# EAGLE design dbLcdRtcUno (EAGLE 8.4.3)
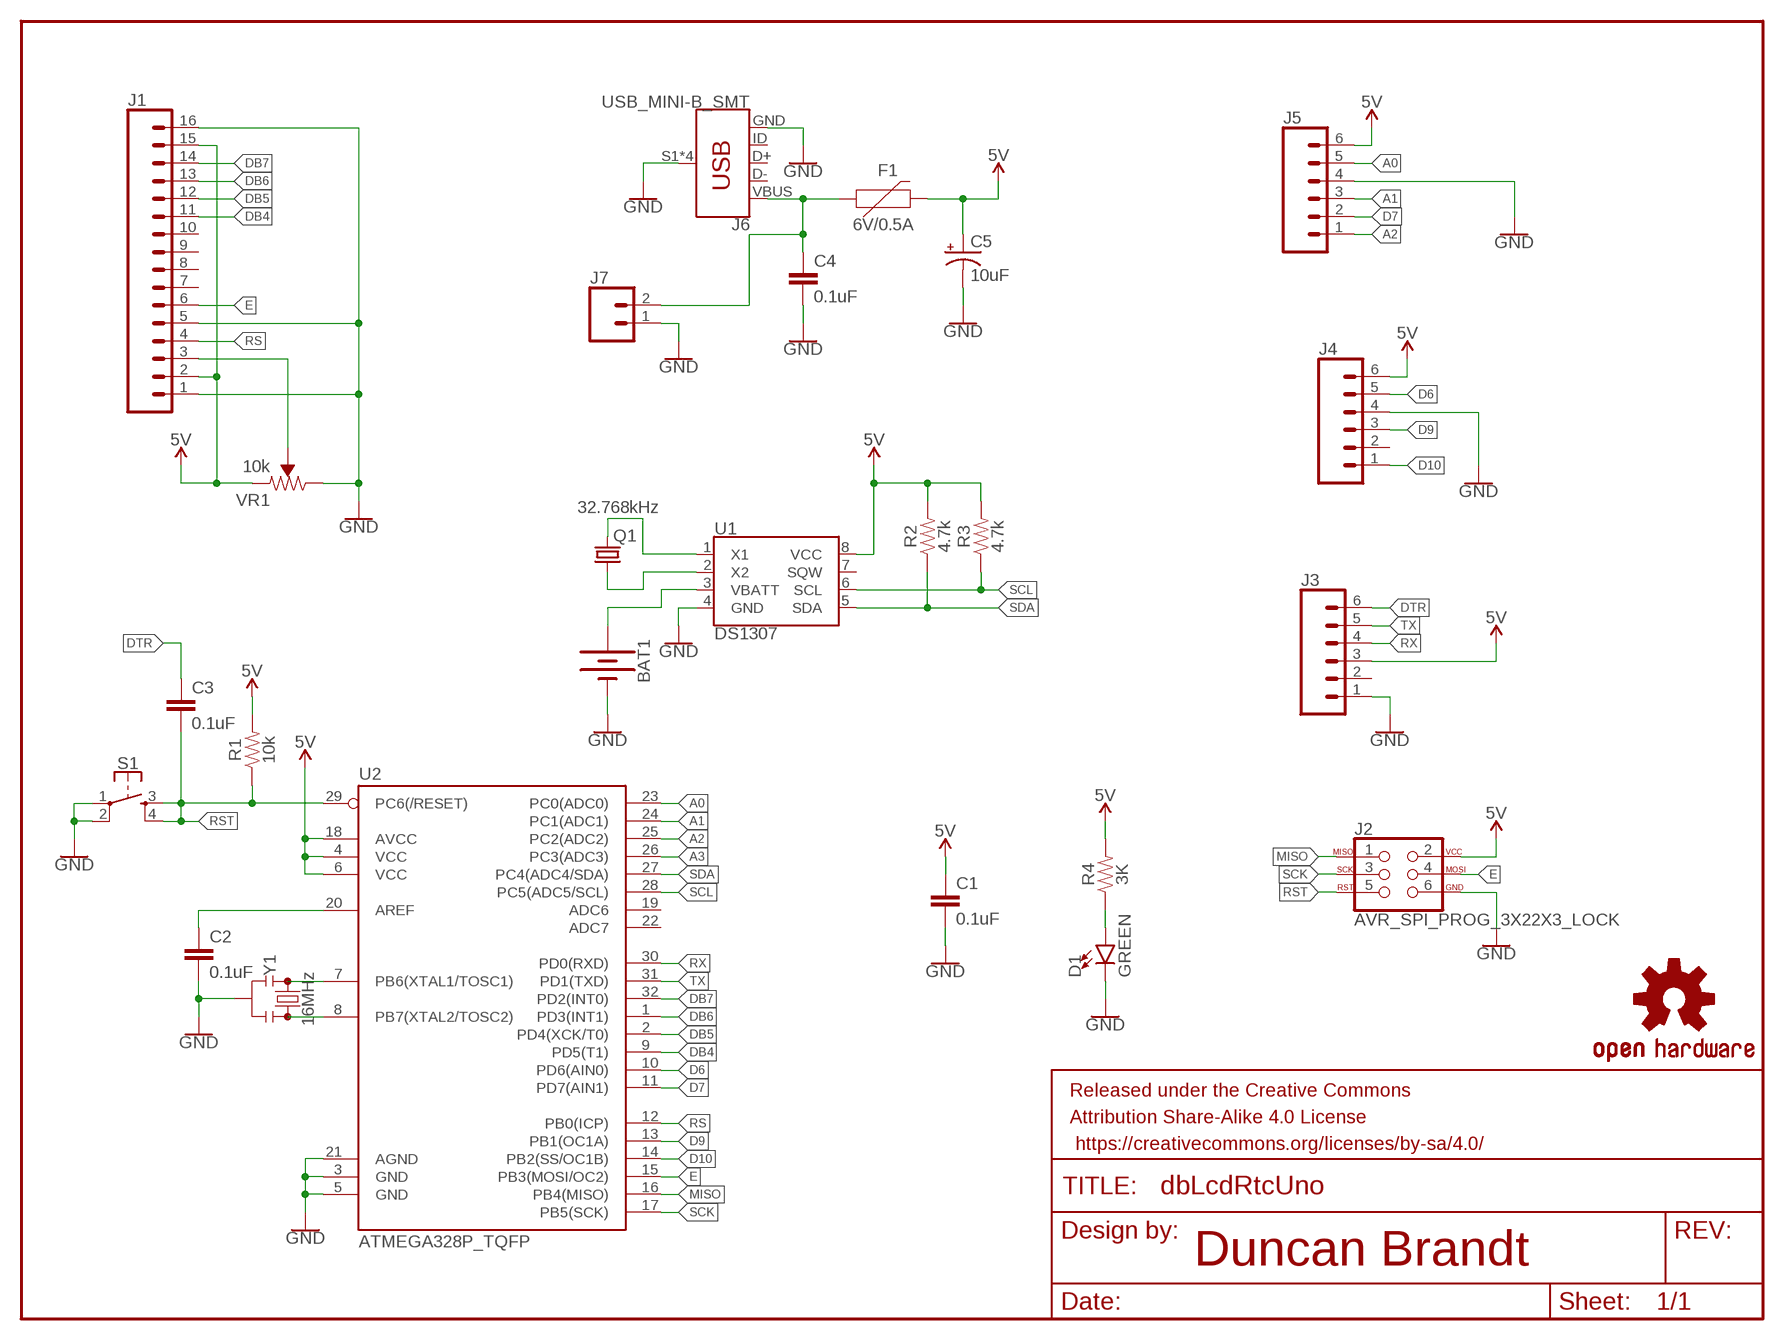
[diagram p0: schematic, sheet 1]

## Parts
BAT1  BATTERY-12MM_PTH  [BATTCON_12MM_PTH]
C1  0.1uF  0.1UF-0603-25V-5%  [0603]
C2  0.1uF  0.1UF-0603-25V-5%  [0603]
C3  0.1uF  0.1UF-0603-25V-5%  [0603]
C4  0.1uF  0.1UF-0603-25V-5%  [0603]
C5  10uF  10UF-POLAR-EIA3216-16V-10%(TANT)  [EIA3216]
D1  GREEN  LED-GREEN1206  [LED-1206]
F1  6V/0.5A  PPTC_HALF-AMP  [1206]
FRAME1  FRAME-LETTER  [CREATIVE_COMMONS]
J1  CONN_16  [1X16]
J2  AVR_SPI_PROG_3X22X3_LOCK  [2X3_LOCK]
J3  CONN_06SILK_FEMALE_PTH  [1X06]
J4  CONN_06SILK_FEMALE_PTH  [1X06]
J5  CONN_06SILK_FEMALE_PTH  [1X06]
J6  USB_MINI-B_SMT  [USB-MINIB]
J7  CONN_02  [1X02]
LOGO1  OSHW-LOGOL  [OSHW-LOGO-L]
Q1  32.768kHz  CRYSTAL-32.768KHZSMD-2X6  [CRYSTAL-SMD-2X6-CYL]
R1  10k  10KOHM-0603-1/10W-1%  [0603]
R2  4.7k  4.7KOHM-0603-1/10W-1%  [0603]
R3  4.7k  4.7KOHM-0603-1/10W-1%  [0603]
R4  3K  3KOHM-0603-1/10W-1%  [0603]
S1  MOMENTARY-SWITCH-SPST-2-SMD-5.2MM  [TACTILE_SWITCH_SMD_5.2MM]
U1  DS1307  DS1307Z  [SO08-0.15]
U2  ATMEGA328P_TQFP  [TQFP32-08]
VR1  10k  TRIMPOT-SMD-3MM-CLOSED-1/8W-20%  [TRIMPOT-SMD-3MM-CLOSED]
Y1  16MHz  RESONATOR-16MHZSMD_3.2X1.3  [RESONATOR-SMD-3.2X1.3]

## Nets
5V: C1.1 C5.+ F1.2 J1.2 J1.15 J2.2 J3.3 J4.6 J5.6 R1.2 R2.2 R3.2 R4.2 U1.8(VCC) U2.4(VCC) U2.6(VCC) U2.18(AVCC) VR1.1(CCW)
A0: J5.5 U2.23(PC0(ADC0))
A1: J5.3 U2.24(PC1(ADC1))
A2: J5.1 U2.25(PC2(ADC2))
A3: U2.26(PC3(ADC3))
D6: J4.5 U2.10(PD6(AIN0))
D7: J5.2 U2.11(PD7(AIN1))
D9: J4.3 U2.13(PB1(OC1A))
D10: J4.1 U2.14(PB2(SS/OC1B))
DB4: J1.11 U2.9(PD5(T1))
DB5: J1.12 U2.2(PD4(XCK/T0))
DB6: J1.13 U2.1(PD3(INT1))
DB7: J1.14 U2.32(PD2(INT0))
DTR: C3.1 J3.6
E: J1.6 J2.4 U2.15(PB3(MOSI/OC2))
GND: BAT1.GND(-) C1.2 C2.2 C4.2 C5.- D1.C J1.1 J1.5 J1.16 J2.6 J3.1 J4.4 J5.4 J6.GND J6.S1(SHIELD) J6.S2(SHIELD) J6.S3(SHIELD) J6.S4(SHIELD) J7.1 S1.1 S1.2 U1.4(GND) U2.3(GND) U2.5(GND) U2.21(AGND) VR1.3(CW) Y1.2
MISO: J2.1 U2.16(PB4(MISO))
N$1: Q1.X2 U1.1(X1)
N$2: Q1.X1 U1.2(X2)
N$3: U2.7(PB6(XTAL1/TOSC1)) Y1.1
N$4: BAT1.VCC@1(+) U1.3(VBATT)
N$5: U2.8(PB7(XTAL2/TOSC2)) Y1.3
N$6: J1.3 VR1.2(WIPER)
N$7: D1.A R4.1
N$8: C2.1 U2.20(AREF)
RS: J1.4 U2.12(PB0(ICP))
RST: C3.2 J2.5 R1.1 S1.3 S1.4 U2.29(PC6(/RESET))
RX: J3.4 U2.30(PD0(RXD))
SCK: J2.3 U2.17(PB5(SCK))
SCL: R3.1 U1.6(SCL) U2.28(PC5(ADC5/SCL))
SDA: R2.1 U1.5(SDA) U2.27(PC4(ADC4/SDA))
TX: J3.5 U2.31(PD1(TXD))
VBUS: C4.1 F1.1 J6.VBUS J7.2
Unconnected: J1.7 J1.8 J1.9 J1.10 J3.2 J4.2 J6.D+ J6.D- J6.ID U1.7(SQW) U2.19(ADC6) U2.22(ADC7)

## Notes on the sheet
- Duncan Brandt

## Library data of the parts
BAT1 = DB-POWER:BATTERY: Battery - Single Cell A variety of battery chemistries, sizes, and footprints.
C1-C4 = DB-CAP:0.1UF: 0.1µF ceramic capacitors Package: 0603 A capacitor is a passive two-terminal electrical component used to store electrical energy temporarily in an electric field. DB BOARDS: DB Drawing Board <www.dbboards.com>; PROD_ID: CAP-08604
C5 = DB-CAP:10UF-POLAR: 10.0µF polarized capacitors Package: EIA3216 A capacitor is a passive two-terminal electrical component used to store electrical energy temporarily in an electric field. DB BOARDS: DB Drawing Board <www.dbboards.com>; PROD_ID: CAP-00811
D1 = DB-LED:LED-GREEN: Green SMD LED Package: 1206 DB BOARDS: DB Drawing Board <www.dbboards.com>
F1 = DB-FUSE:PPTC: Resettable Fuse PPTC Package: 1206 DB BOARDS: DB Drawing Board <www.dbboards.com>; PROD_ID: RES-08585
FRAME1 = DB-SYMBOLS:FRAME-LETTER: Schematic Frame - Letter Standard 8.5x11 US Letter frame
J1 = DB-CONN:CONN_16: Multi connection point. Often used as Generic Header-pin footprint for 0.1 inch spaced/style header connections
J2 = DB-CONN:AVR_SPI_PROG_3X2: AVR ISP 6 Pin This is the reduced ISP connector for AVR programming. Common on Arduino. This footprint will take up less PCB space and can be used with a 10-pin to 6-pin adapter
J3-J5 = DB-CONN:CONN_06: 6 Pin Header Multi connection point. Often used as Generic Header-pin footprint for 0.1 inch spaced/style header connections DB BOARDS: DB Drawing Board <www.dbboards.com>; PROD_ID: CONN-08437
J6 = DB-CONN:USB_MINI-B: USB type Mini-B Connector Package: USB-MINIB DB BOARDS: DB Drawing Board <www.dbboards.com>; PROD_ID: CONN-08193; SF_ID: PRT-00587
J7 = DB-CONN:CONN_02: 2 Pin Header Single connection point. Often used as Generic Header-pin footprint for 0.1 inch spaced/style header connections DB BOARDS: DB Drawing Board <www.dbboards.com>
LOGO1 = DB-SYMBOLS:OSHW-LOGO: Open-Source Hardware (OSHW) Logo This logo indicates the piece of hardware it is found on incorporates a OSHW license and/or adheres to the definition of open source hardware found here: http://freedomdefined.org/OSHW
Q1 = DB-CLOCK:CRYSTAL-32.768KHZ: 32.768kHz Crystal Frequency: 32.768kHz Frequency Stability: ±20ppm Load Capacitance: 12.5pF (PTH-2X6 & SMD-3.2X1.5), 6pF (SMD-2X6)
R1 = DB-RES:10KOHM: 10kΩ Resistor Package: 0603 A resistor is a passive two-terminal electrical component that implements electrical resistance as a circuit element. Resistors act to reduce current flow, and, at the same time, act to lower voltage levels within circuits. - Wikipedia DB BOARDS: DB Drawing Board <www.dbboards.com>; PROD_ID: RES-00824
R2 R3 = DB-RES:4.7KOHM: 4.7kΩ Resistor Package: 0603 A resistor is a passive two-terminal electrical component that implements electrical resistance as a circuit element. Resistors act to reduce current flow, and, at the same time, act to lower voltage levels within circuits. - Wikipedia DB BOARDS: DB Drawing Board <www.dbboards.com>; PROD_ID: RES-07857
R4 = DB-RES:3KOHM: 3kΩ Resistor Package: 0603 A resistor is a passive two-terminal electrical component that implements electrical resistance as a circuit element. Resistors act to reduce current flow, and, at the same time, act to lower voltage levels within circuits. - Wikipedia DB BOARDS: DB Drawing Board <www.dbboards.com>; PROD_ID: RES-09334
S1 = DB-BTNSWTCH:MOMENTARY-SWITCH-SPST-2: SMD Momentary Push Button Package: SPST 4PIN DB BOARDS: DB Drawing Board <www.dbboards.com>; PROD_ID: SWCH-08247; SF_SKU: COM-08720
U1 = DB-IC:DS1307: Maxim DS1307 - I2C Real-time clock (RTC) The DS1307 serial real-time clock (RTC) is a low-power, full binary-coded decimal (BCD) clock/calendar plus 56 bytes of NV SRAM. Address and data are transferred serially through an I2C, bidirectional bus. The clock/calendar provides seconds, minutes, hours, day, date, month, and year information.
U2 = DB-IC-Microcontroller:ATMEGA328P_TQFP: ATMEGA 328P Package: TQFP32 Arduino Programmable IC DB BOARDS: DB Drawing Board <www.dbboards.com>; PROD_ID: IC-09069
VR1 = DB-RES:TRIMPOT: Trimming Potentiometer (Trimpot) Three-terminal potentiometers, variable resistor.; PROD_ID: RES-09285
Y1 = DB-CLOCK:RESONATOR-16MHZ: 16MHz Resonator Package: 3.2x1.3 DB BOARDS: DB Drawing Board <www.dbboards.com>; PROD_ID: XTAL-08900

## Board
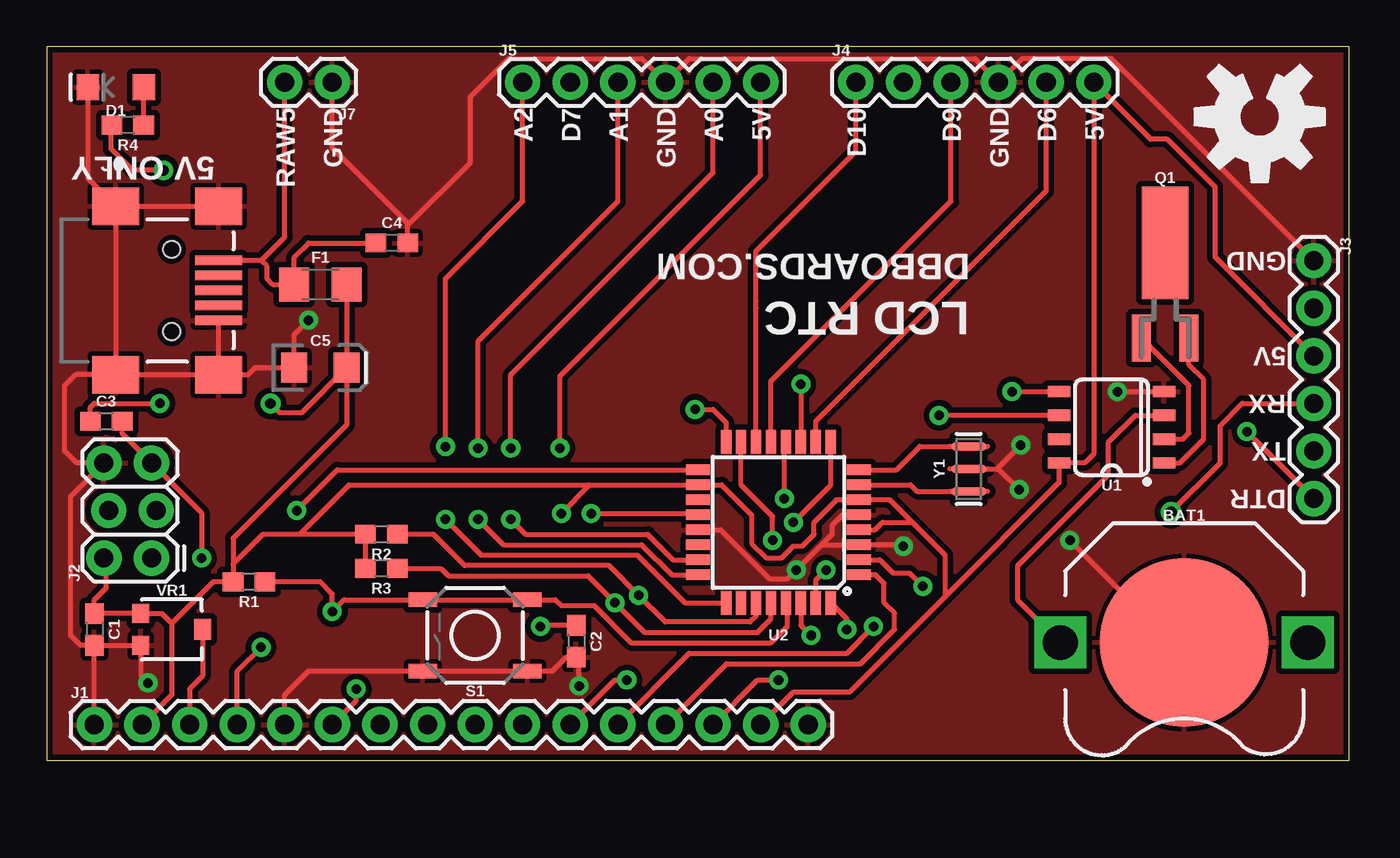
[diagram p1: board, top side]
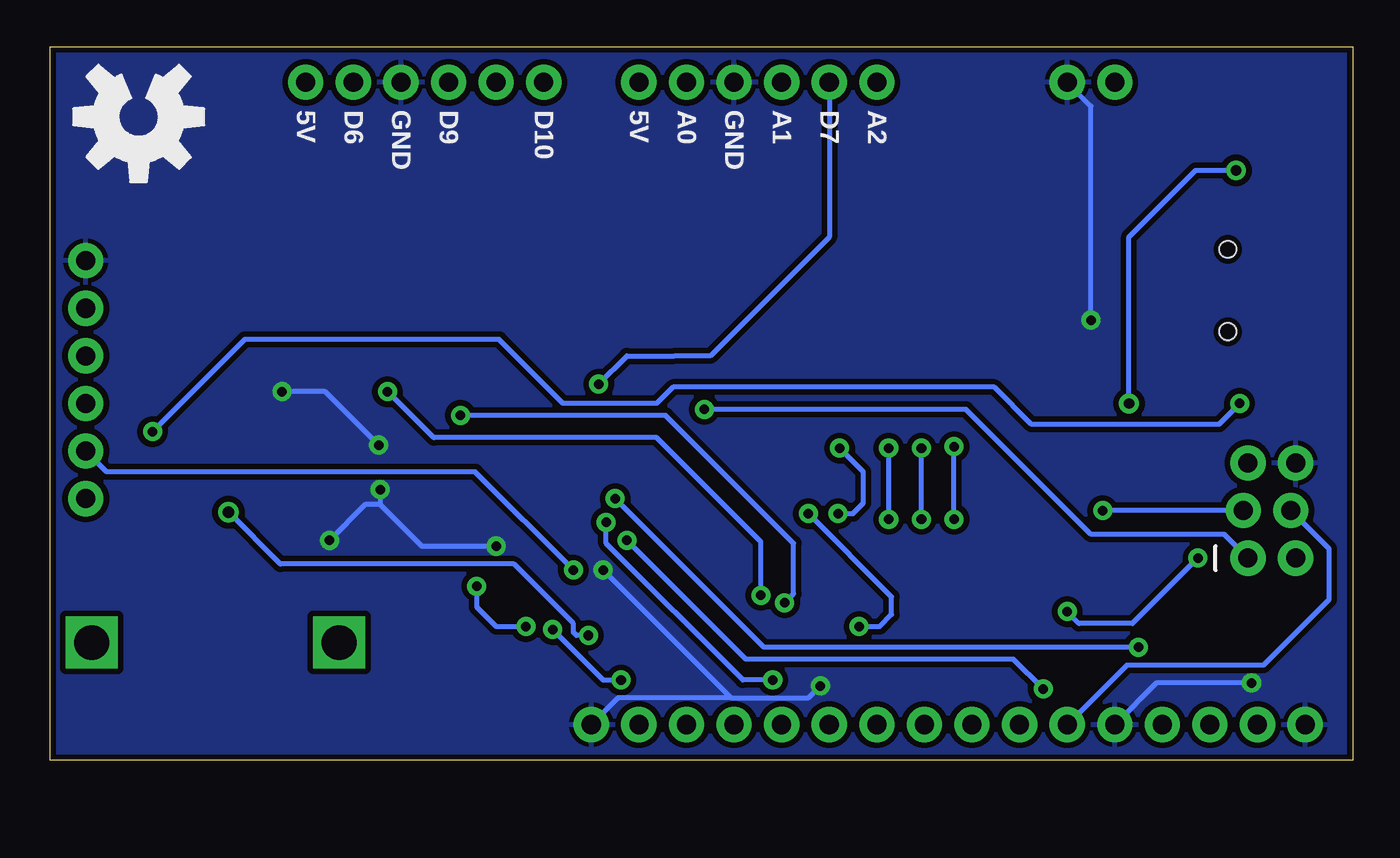
[diagram p2: board, bottom side, seen from below]

Size 69.52 x 38.09 mm. Coordinates in mm from the lower left corner, seen from the top.
Outline: 0,0 69.52,0 69.52,38.09 0,38.09 0,0
Copper layers (1*16): Top 0.035mm / dielectric 1.5mm / Bottom 0.035mm
Design rules "SparkFun-2-layer-STANDARD": minimum track width 10mil, minimum drill 20mil, track to track 10mil, track to pad 8mil, pad to pad 8mil, via to via 10mil, smd to smd 8mil, copper to edge 8mil, drill to drill 8mil, minimum pad ring 10mil, minimum via ring 10mil, stop-mask expansion 4mil, vias tented up to drill 25mil, thermal gap 10mil

### Footprints (pad centres in the part's own frame; a part is rotated, then mirrored left to right if it is on the bottom)
BATTCON_12MM_PTH = smd 9 x 9: GND 0,0 | drill 1.854 square: VCC@1 6.604,0; VCC@2 -6.604,0
0603 = smd 1.1 x 1: 1 -0.85,0; 2 0.85,0
EIA3216 = smd 1.4 x 1.6: + 1.4,0; - -1.4,0
LED-1206 = smd 1.2 x 1.4: A -1.5,0; C 1.5,0
1206 = smd 1.6 x 1.8: 1 -1.4,0; 2 1.4,0
1X16 = drill 1.016 pad 1.88: 1 0,0; 2 2.54,0; 3 5.08,0; 4 7.62,0; 5 10.16,0; 6 12.7,0; 7 15.24,0; 8 17.78,0; 9 20.32,0; 10 22.86,0; 11 25.4,0; 12 27.94,0; 13 30.48,0; 14 33.02,0; 15 35.56,0; 16 38.1,0
2X3_LOCK = drill 1.016 pad 1.88: 1 0,0.127; 2 0,2.667; 3 2.54,-0.127; 4 2.54,2.413; 5 5.08,0.127; 6 5.08,2.667
1X06 = drill 1.016 pad 1.88: 1 0,0; 2 2.54,0; 3 5.08,0; 4 7.62,0; 5 10.16,0; 6 12.7,0
USB-MINIB = smd 2.5 x 0.5: D+ 2.5,0; D- 2.5,0.8; GND 2.5,-1.6; ID 2.5,-0.8; VBUS 2.5,1.6 | smd 2.5 x 2: S1 -3,4.5; S2 2.5,4.5; S3 -3,-4.5; S4 2.5,-4.5 | hole 0.9: 0,2.2; 0,-2.2
1X02 = drill 1.016 pad 1.88: 1 0,0; 2 2.54,0
CRYSTAL-SMD-2X6-CYL = smd 2.5 x 6: SHEILD 0,5.08 | smd 1 x 2.5: X1 -1.27,0; X2 1.27,0
TACTILE_SWITCH_SMD_5.2MM = smd 1.524 x 0.762: 1 -2.794,1.905; 2 2.794,1.905; 3 -2.794,-1.905; 4 2.794,-1.905
SO08-0.15 = smd 0.6 x 1.2: 1 -1.905,-2.8; 2 -0.635,-2.8; 3 0.635,-2.8; 4 1.905,-2.8; 5 1.905,2.8; 6 0.635,2.8; 7 -0.635,2.8; 8 -1.905,2.8
TQFP32-08 = smd 1.27 x 0.559: 1 -4.293,2.8; 2 -4.293,2; 3 -4.293,1.2; 4 -4.293,0.4; 5 -4.293,-0.4; 6 -4.293,-1.2; 7 -4.293,-2; 8 -4.293,-2.8; 17 4.293,-2.8; 18 4.293,-2; 19 4.293,-1.2; 20 4.293,-0.4; 21 4.293,0.4; 22 4.293,1.2; 23 4.293,2; 24 4.293,2.8 | smd 0.559 x 1.27: 9 -2.8,-4.293; 10 -2,-4.293; 11 -1.2,-4.293; 12 -0.4,-4.293; 13 0.4,-4.293; 14 1.2,-4.293; 15 2,-4.293; 16 2.8,-4.293; 25 2.8,4.293; 26 2,4.293; 27 1.2,4.293; 28 0.4,4.293; 29 -0.4,4.293; 30 -1.2,4.293; 31 -2,4.293; 32 -2.8,4.293
TRIMPOT-SMD-3MM-CLOSED = smd 1 x 0.9: 1 -0.85,-1.65; 3 0.85,-1.65 | smd 1.1 x 0.9: 2 0,1.65
RESONATOR-SMD-3.2X1.3 = smd 0.45 x 1.905: 1 -1.2,0; 2 0,0; 3 1.2,0

### Placement (x,y rotation side)
BAT1  60.71,6.29 180 top
C1  2.54,6.99 270 top
C2  28.26,6.35 270 top
C3  3.17,18.1 0 top
C4  18.41,27.62 0 top
C5  14.61,20.95 0 top
D1  3.68,35.94 180 top
F1  14.61,25.4 0 top
FRAME1  -101.6,16.51 0 top  (outside the outline)
J1  2.54,1.91 0 top
J2  5.71,10.79 90 top
J3  67.63,26.67 270 top
J4  43.18,36.2 0 top
J5  25.4,36.2 0 top
J6  6.67,25.08 0 top
J7  15.24,36.2 180 top
LOGO1  64.74,34.35 180 top
LOGO2  OSHW-LOGOL  [OSHW-LOGO-L]  64.8,34.35 180 bottom
Q1  59.69,22.54 0 top
R1  10.79,9.53 180 top
R2  17.86,12.06 180 top
R3  17.86,10.24 180 top
R4  4.32,33.91 180 top
S1  22.86,6.67 180 top
U1  56.83,17.78 90 top
U2  39.05,12.7 180 top
VR1  6.67,6.99 270 top
Y1  49.21,15.56 90 top

### Tracks (layer width: path | path; a pad name or v marks a point on that pad's centre or on a via)
5V  (via drill 0.51, 0.55)
  Top 0.254: 6.67,7.3 6.13,7.83 VR1.1 C1.1 2.54,8.57 3.17,9.21 3.17,10.67 J2.2 | 6.67,7.3 6.67,3.49 J1.2 | 6.67,7.3 8.89,9.53 R1.2 9.95,10.48 | F1.2 C5.+ | C5.+ 16,17.91 9.95,11.85 9.95,10.48 | 9.95,10.48 11.53,12.06 13.49,12.06 | 13.49,12.06 16.13,14.7 28.89,14.7 | 28.89,14.7 U2.18 | J1.15 39.85,3.65 42.86,3.65 47.94,8.73 | 47.94,8.73 47.94,10.95 46.2,12.7 | 46.2,12.7 45,13.9 U2.6 42.16,13.9 40.96,12.7 40.96,12.06 40.32,11.43 39.85,11.43 39.21,10.79 38.42,10.79 37.62,11.59 37.62,13.1 36.02,14.7 U2.18 | 34.82,14.76 U2.18 | 47.94,8.73 54.03,14.82 U1.8 55.4,15.88 55.88,16.35 J4.6 58.93,33.15 59.82,33.15 62.36,30.61 62.36,26.86 J3.3 | 28.89,14.7 28.89,14.61 v27.46,13.18 | 13.49,12.06 R2.2 R3.2 | U2.4 44.21,12.3 44.61,12.7 46.2,12.7 | J5.6 38.1,31.24 27.38,20.53 v27.38,16.67 | C5.+ 13.59,18.54 12.45,18.54 v11.94,19.05 | v6.22,31.5 4.57,31.5 3.43,32.64 3.43,33.87 R4.2
  Bottom 0.254: v27.46,13.18 26.67,13.18 26.11,13.73 26.11,15.4 v27.38,16.67 | v11.94,19.05 11.94,27.94 8.38,31.5 v6.22,31.5
A0  (via drill 0.51)
  Top 0.254: U2.23 33.43,10.7 32.07,12.06 25.56,12.06 v24.77,12.86 | J5.5 35.56,31.37 24.77,20.57 v24.77,16.67
  Bottom 0.254: v24.77,12.86 v24.77,16.67
A1  (via drill 0.51)
  Top 0.254: U2.24 33.36,9.9 31.75,11.51 24.37,11.51 v23.02,12.86 | v23.02,16.67 23.02,22.38 30.48,29.84 J5.3
  Bottom 0.254: v23.02,12.86 v23.02,16.67
A2  (via drill 0.51)
  Top 0.254: U2.25 34.06,8.41 31.51,10.95 23.18,10.95 v21.27,12.86 | v21.27,16.75 21.27,25.72 25.4,29.84 J5.1
  Bottom 0.254: v21.27,12.86 v21.27,16.75
D6
  Top 0.254: 41.05,17.56 U2.10 41.05,18.11 53.34,30.4 J4.5
D7  (via drill 0.51)
  Top 0.254: v40.24,20.08 40.24,17 U2.11
  Bottom 0.254: v40.24,20.08 38.73,21.59 36.2,21.59 34.29,21.59 27.94,27.94 J5.2
D9
  Top 0.254: U2.13 38.65,20.24 48.26,29.84 J4.3
D10
  Top 0.254: U2.14 37.85,24.13 | 37.85,24.13 37.85,24.52 | 37.85,24.13 37.85,27.18 43.18,32.51 J4.1
DB4  (via drill 0.51)
  Top 0.254: J1.11 30.32,4.29 v30.96,4.29 | v39.85,12.7 41.85,14.71 U2.9
  Bottom 0.254: v30.96,4.29 32.54,4.29 39.85,11.59 v39.85,12.7
DB5  (via drill 0.51)
  Top 0.254: J1.12 34.29,5.71 42.7,5.71 v44.13,7.14 | U2.2 44.47,10.7 45.16,10 46.04,10 v46.75,9.29
  Bottom 0.254: v46.75,9.29 46.75,8.18 45.72,7.14 v44.13,7.14
DB6
  Top 0.254: U2.1 44.23,9.9 44.69,9.45 44.69,8.41 45.24,7.86 45.24,6.99 43.42,5.16 36.27,5.16 J1.13
DB7  (via drill 0.51)
  Top 0.254: J1.14 37.94,4.29 v39.05,4.29 | U2.32 42.7,7.56 v42.7,6.99
  Bottom 0.254: v42.7,6.99 40.01,4.29 v39.05,4.29
DTR  (via drill 0.51)
  Top 0.254: C3.1 2.33,18.84 2.54,19.05 v6.03,19.05 | v64.06,17.54 J3.6
  Bottom 0.254: v6.03,19.05 7.14,17.94 17.14,17.94 19.13,19.92 36.27,19.92 37.15,19.05 42.15,19.05 45.56,22.46 59.13,22.46 v64.06,17.54
E  (via drill 0.51)
  Top 0.254: J1.6 16.51,3.17 v16.51,3.81 | v38.73,11.75 38.73,13.02 37.05,14.7 U2.15
  Bottom 0.254: J2.4 1.27,11.3 1.27,8.57 4.76,5.08 12.06,5.08 J1.6 | v16.51,3.81 18.1,5.4 32.38,5.4 v38.73,11.75
GND  (via drill 0.51)
  Top 0.254: J1.1 C1.2 | C1.2 VR1.3 5.02,4.51 v5.4,4.13 | C1.2 1.8,6.13 1.27,6.67 1.27,14.1 J2.6 1.59,15.88 0.95,16.51 0.95,20 1.53,20.58 J6.S3 | J6.S3 J6.S4 | J6.S4 10.74,20.58 11.11,20.95 C5.- 13.21,22.73 v13.97,23.5 | J6.S4 J6.GND | J6.S1 J6.S2 | J6.S1 J6.S3 | C4.2 19.27,28.57 | 19.27,28.57 19.27,28.68 15.24,32.7 J7.1 | J1.5 12.7,3.49 13.97,4.76 S1.2 S1.1 26.99,4.76 27.73,5.5 C2.2 28.42,5.34 v28.42,3.97 | U2.21 35.96,12.3 38.58,9.68 39.53,9.68 v40.01,10.16 41.34,11.5 | 41.34,11.5 U2.3 45.65,11.5 v45.72,11.43 | Y1.2 50.8,15.56 | 50.8,15.56 v51.91,14.45 | U2.5 42.47,13.1 41.91,12.54 41.91,12.06 41.34,11.5 | 50.8,15.56 50.8,15.64 v51.99,16.83 | v57.15,19.68 U1.4 | 19.27,28.57 22.61,31.92 22.61,35.43 24.64,37.47 31.75,37.47 J5.4 34.29,37.47 49.53,37.47 J4.4 52.07,37.47 56.83,37.47 J3.1 | v54.61,11.75 60.07,6.29 BAT1.GND | D1.C 2.18,31.07 J6.S1
  Bottom 0.254: v5.4,4.13 10.48,4.13 J1.5 | J1.16 39.21,3.33 33.18,3.33 | v28.42,3.97 29.05,3.33 33.18,3.33 | v40.01,10.16 33.18,3.33 | v51.91,14.45 51.91,13.65 | v45.72,11.43 49.69,11.43 51.91,13.65 | 51.91,13.65 52.7,13.65 v54.61,11.75 | v51.99,16.83 54.85,19.68 v57.15,19.68 | J7.1 13.97,34.92 v13.97,23.5
  pour Top (isolate 0.305): 0.08,37.97 69.45,37.97 69.53,31.67 69.53,0 69.61,-0.08 0,-0.08 0,31.75
  pour Bottom (isolate 0.305): 0,37.97 69.53,37.97 69.53,0 0,0
MISO  (via drill 0.51)
  Top 0.254: v34.61,18.73 35.56,18.73 36.25,18.04 U2.16
  Bottom 0.254: J2.1 6.86,12.06 13.97,12.06 20.64,18.73 v34.61,18.73
N$1
  Top 0.254: U1.1 60.48,15.88 61.75,17.14 61.75,20.32 60.96,21.11 Q1.X2
N$2
  Top 0.254: U1.2 60.64,17.14 60.96,17.46 60.96,20 Q1.X1
N$3
  Top 0.254: U2.7 46.1,14.7 46.44,14.36 Y1.1
N$4
  Top 0.254: U1.3 58.1,18.41 56.67,16.99 56.67,15.24 51.82,10.38 51.82,8.57 BAT1.VCC@1
N$5
  Top 0.254: U2.8 45.34,15.5 46.6,16.76 Y1.3
N$6
  Top 0.254: VR1.2 8.32,4.51 7.62,3.81 J1.3
N$7
  Top 0.254: R4.1 5.17,35.93 D1.A
N$8  (via drill 0.51)
  Top 0.254: C2.1 26.41,7.2 v26.35,7.14 | v29.05,13.18 34.68,13.18 U2.20
  Bottom 0.254: v26.35,7.14 25.24,7.14 24.61,7.78 24.61,8.73 v29.05,13.18
RS  (via drill 0.51)
  Top 0.254: J1.4 10.16,4.76 v11.43,6.03 | v39.37,13.97 39.37,16.91 U2.12
  Bottom 0.254: v11.43,6.03 31.43,6.03 v39.37,13.97
RST  (via drill 0.51)
  Top 0.254: C3.2 4.03,17.44 J2.5 8.26,13.21 v8.26,10.79 | R1.1 14.61,9.53 15.24,8.89 v15.24,7.94 15.88,8.57 S1.4 S1.3 27.15,8.57 27.46,8.26 29.21,8.26 31.19,6.27 38.66,6.27 39.53,7.14 39.53,8.33 U2.29
  Bottom 0.254: v8.26,10.79 11.75,7.3 14.61,7.3 v15.24,7.94
RX  (via drill 0.51, 0.6)
  Top 0.254: U2.30 40.25,7.21 v40.8,6.67 | v60.01,13.24 62.63,15.87 62.63,17.86 63.82,19.05 J3.4
  Bottom 0.254: v40.8,6.67 41.43,6.67 41.59,6.83 41.59,7.3 44.77,10.48 57.24,10.48 v60.01,13.24
SCK  (via drill 0.51)
  Top 0.254: v13.34,13.34 15.5,15.5 U2.17
  Bottom 0.254: J2.3 v13.34,13.34
SCL  (via drill 0.51)
  Top 0.254: U2.28 38.65,7.54 37.94,6.83 31.91,6.83 v30.32,8.41 28.89,9.84 21.43,9.84 21.03,10.24 R3.1 | U1.6 v47.62,18.41
  Bottom 0.254: v47.62,18.41 36.67,18.41 29.84,11.59 29.84,8.89 v30.32,8.41
SDA  (via drill 0.51)
  Top 0.254: U2.27 37.85,7.69 37.54,7.38 33.02,7.38 v31.59,8.81 30,10.4 22.3,10.4 20.64,12.06 R2.1 | v51.51,19.68 U1.5
  Bottom 0.254: v31.59,8.81 31.59,11.67 37.15,17.22 49.05,17.22 v51.51,19.68
TX  (via drill 0.51)
  Top 0.254: U2.31 41.05,9.62 v41.59,10.16
  Bottom 0.254: v41.59,10.16 46.83,15.4 66.52,15.4 J3.5
VBUS
  Top 0.254: 11.44,26.68 J6.VBUS | 11.44,26.68 12.7,27.94 J7.2 | 11.44,26.68 11.75,26.38 11.75,25.72 12.06,25.4 F1.1 13.21,26.86 13.97,27.62 C4.1

### Text on the board
tPlace: RAW5 | GND | A2 | D7 | A1 | GND | A0 | 5V | D10 | D9 | GND | D6 | 5V | 5V ONLY | DBBOARDS.COM | GND | LCD RTC | 5V | RX | TX | DTR
bPlace: A2 | D7 | A1 | GND | A0 | 5V | D10 | D9 | GND | D6 | 5V